# EAGLE schematic untitled (EAGLE 8.3.0)
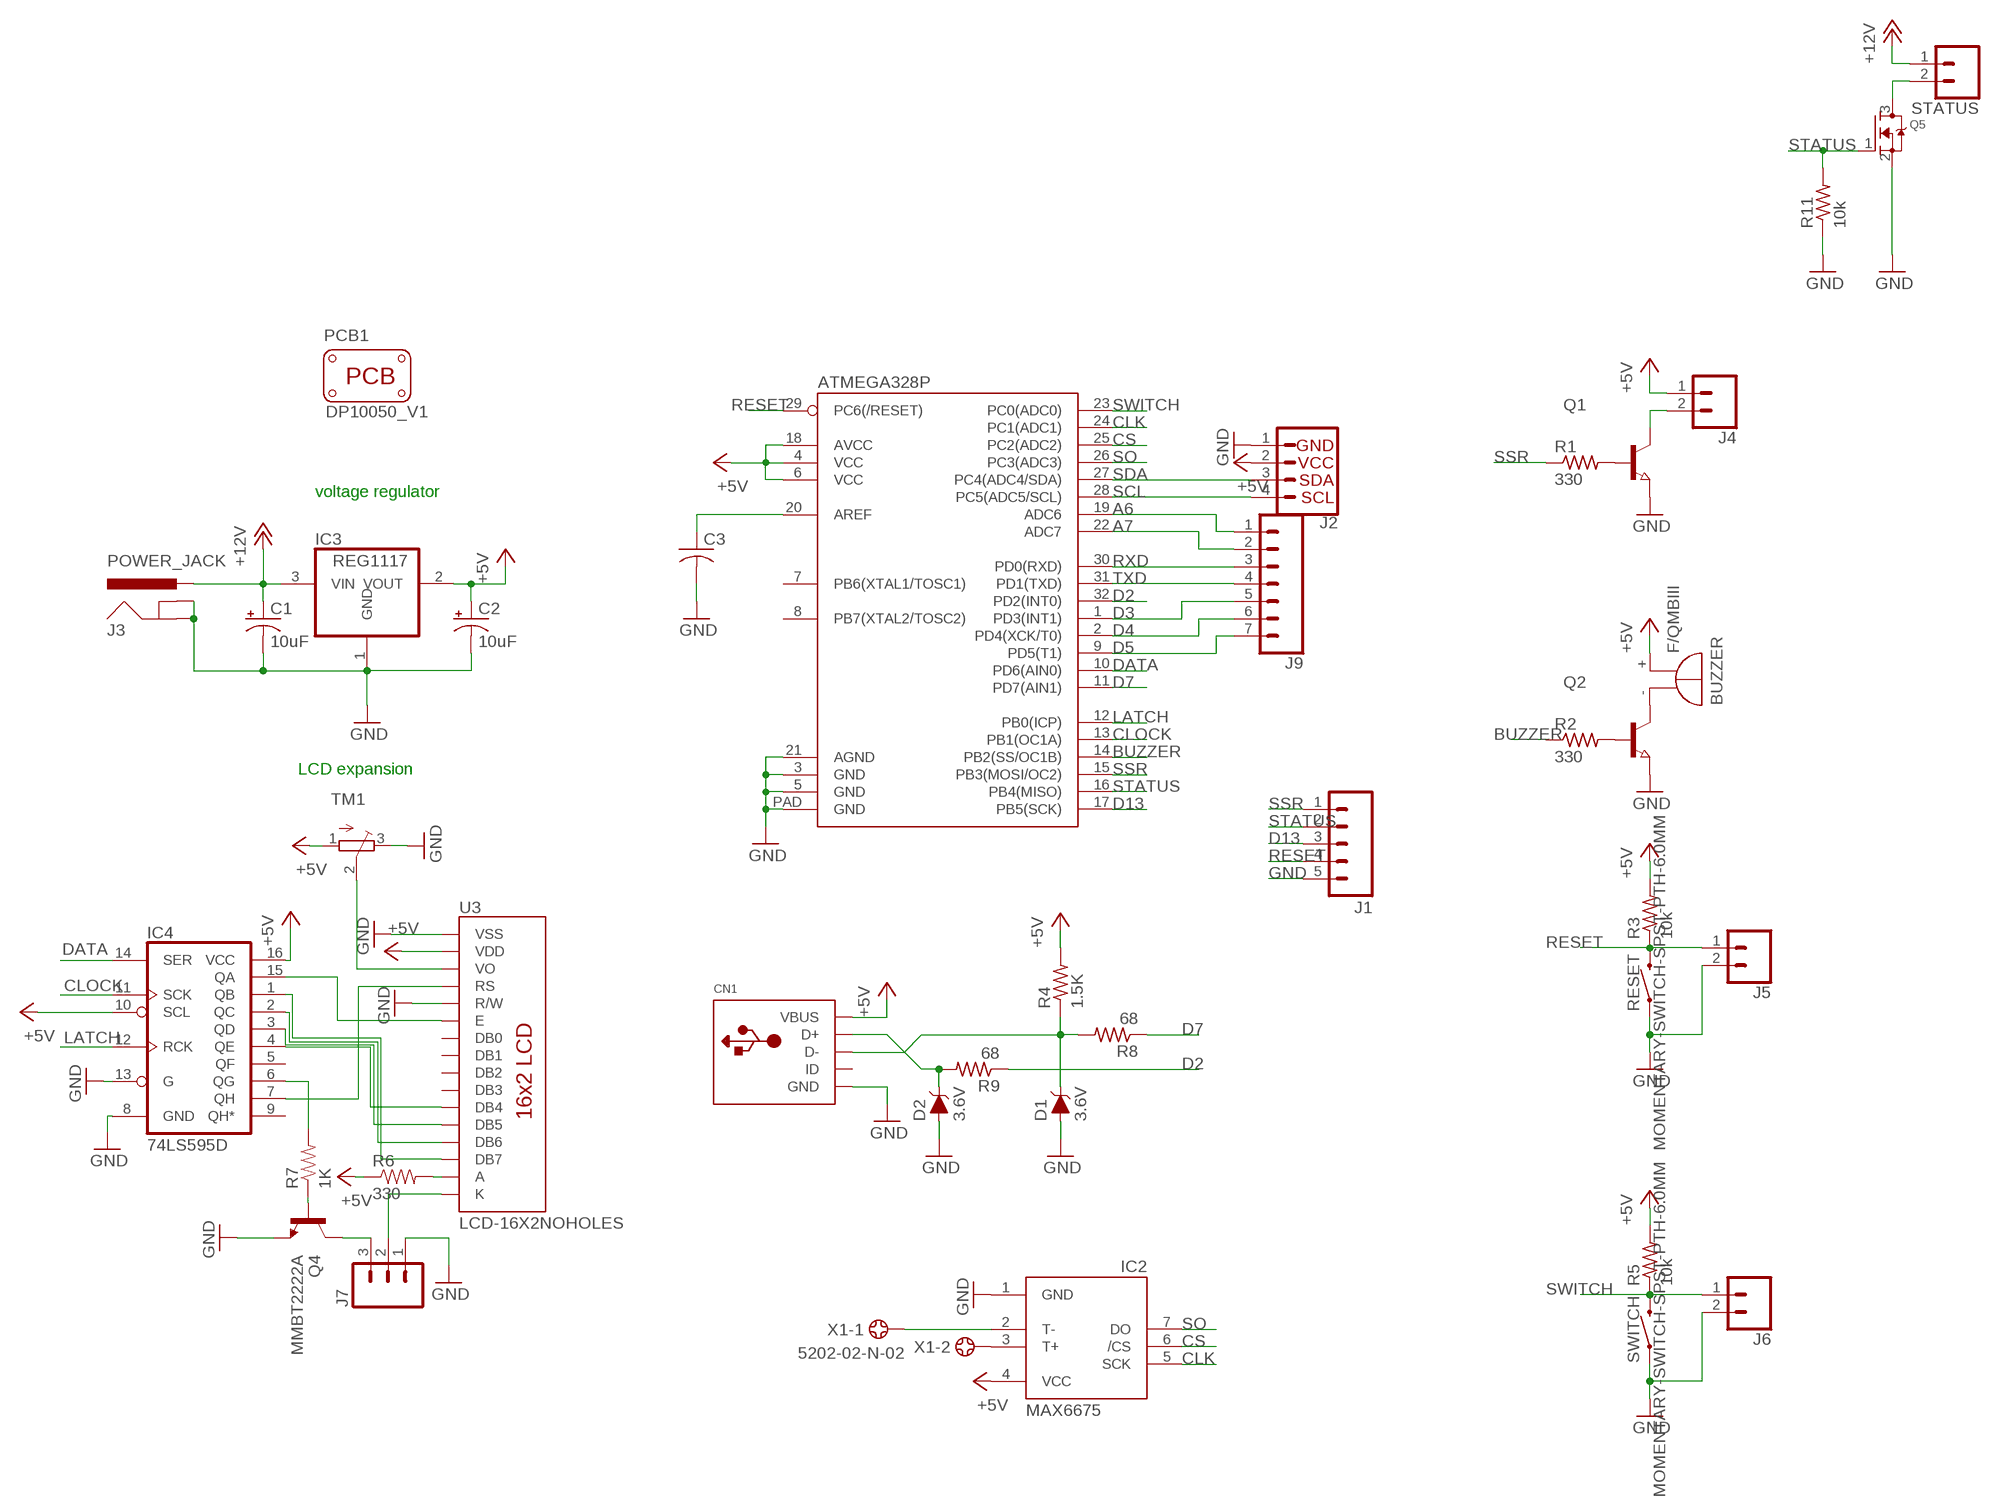
[diagram p0: schematic, sheet 1]

## Parts
ATMEGA328P  ATMEGA328P_MLFMLF32  [MLF32-PAD]
BUZZER  F/QMBIII  [F/QMBIII]
C1  10uF  CPOL-USCT3216  [CT3216]
C2  10uF  CPOL-USCT3216  [CT3216]
C3  C-USC0603  [C0603]
CN1  USBMINIB  [USB-MINIB]
D1  3.6V  DIODE-ZENER-BZT52C3V6S  [SOD-323]
D2  3.6V  DIODE-ZENER-BZT52C3V6S  [SOD-323]
IC2  MAX6675  [SO08]
IC3  REG1117  [SOT223]
IC4  74LS595D  [SO16]
J1  M051.27MM  [1X05-1.27MM]
J2  I2C_STANDARD  [1X04]
J3  POWER_JACK  [POWER_JACK_PTH]
J4  CONN_02  [1X02]
J5  CONN_02  [1X02]
J6  CONN_02  [1X02]
J7  M03PTH  [1X03]
J9  CONN_07  [1X07]
PCB1  PCB_DP_RECTANGLE-50X100  [DP10050_V1]
Q1  NPN-TRANSISTOR_SOT23  [SOT23]
Q2  NPN-TRANSISTOR_SOT23  [SOT23]
Q4  MMBT2222A  TRANSISTOR_NPNMMBT2222A  [SOT23-3]
Q5  MOSFET-NREFLOW  [SOT23]
R1  330  R-US_R0603  [R0603]
R2  330  R-US_R0603  [R0603]
R3  10k  R-US_R0603  [R0603]
R4  1.5K  R-US_R0603  [R0603]
R5  10k  R-US_R0603  [R0603]
R6  330  0.3OHM-1/8W-1%(0805)  [0805]
R7  1K  0.3OHM-1/8W-1%(0805)  [0805]
R8  68  R-US_R0603  [R0603]
R9  68  R-US_R0603  [R0603]
R11  10k  R-US_R0603  [R0603]
RESET  MOMENTARY-SWITCH-SPST-PTH-6.0MM  [TACTILE_SWITCH_PTH_6.0MM]
STATUS  CONN_02  [1X02]
SWITCH  MOMENTARY-SWITCH-SPST-PTH-6.0MM  [TACTILE_SWITCH_PTH_6.0MM]
TM1  TRIMPOT3386  [TRIM-3386]
U3  LCD-16X2NOHOLES  [LCD-16X2_NOHOLES]
X1  5202-02-N-02  [5202-02-N-02]

## Nets
+5V: ATMEGA328P.4(VCC) ATMEGA328P.6(VCC) ATMEGA328P.18(AVCC) BUZZER.+(-) C2.+ CN1.VBUS IC2.4(VCC) IC3.2(VOUT) IC4.10(SCL) IC4.16(VCC) J2.2 J4.1 R3.2 R4.2 R5.2 R6.1 TM1.1(A) U3.2(VDD)
+12V: C1.+ IC3.3(VIN) J3.PWR STATUS.1
A6: ATMEGA328P.19(ADC6) J9.1
A7: ATMEGA328P.22(ADC7) J9.2
BUZZER: ATMEGA328P.14(PB2(SS/OC1B)) R2.1
CLK: ATMEGA328P.24(PC1(ADC1)) IC2.5(SCK)
CLOCK: ATMEGA328P.13(PB1(OC1A)) IC4.11(SCK)
CS: ATMEGA328P.25(PC2(ADC2)) IC2.6(/CS)
D2: ATMEGA328P.32(PD2(INT0)) R9.1
D3: ATMEGA328P.1(PD3(INT1)) J9.5
D4: ATMEGA328P.2(PD4(XCK/T0)) J9.6
D5: ATMEGA328P.9(PD5(T1)) J9.7
D7: ATMEGA328P.11(PD7(AIN1)) R8.1
D13: ATMEGA328P.17(PB5(SCK)) J1.3
DATA: ATMEGA328P.10(PD6(AIN0)) IC4.14(SER)
GND: ATMEGA328P.3(GND) ATMEGA328P.5(GND) ATMEGA328P.21(AGND) ATMEGA328P.PAD(GND) C1.- C2.- C3.2 CN1.GND D1.A D2.A IC2.1(GND) IC3.1(GND) IC4.8(GND) IC4.13(G) J1.5 J2.1 J3.GND J3.GNDBREAK J5.2 J6.2 J7.1 Q1.2(E) Q2.2(E) Q4.2(E) Q5.2(S) R11.1 RESET.1 SWITCH.1 TM1.3(E) U3.1(VSS) U3.5(R/W)
LATCH: ATMEGA328P.12(PB0(ICP)) IC4.12(RCK)
N$1: BUZZER.-(+) Q2.3(C)
N$2: IC2.2(T-) X1.1
N$3: IC2.3(T+) X1.2
N$4: Q1.1(B) R1.2
N$5: Q2.1(B) R2.2
N$6: ATMEGA328P.20(AREF) C3.1
N$7: J4.2 Q1.3(C)
N$8: R6.2 U3.15(A)
N$9: TM1.2(S) U3.3(VO)
N$10: IC4.7(QH) U3.4(RS)
N$11: IC4.15(QA) U3.6(E)
N$12: IC4.4(QE) U3.11(DB4)
N$13: IC4.3(QD) U3.12(DB5)
N$14: IC4.2(QC) U3.13(DB6)
N$15: IC4.1(QB) U3.14(DB7)
N$16: J7.2 U3.16(K)
N$17: J7.3 Q4.3(C)
N$18: Q4.1(B) R7.1
N$19: IC4.6(QG) R7.2
N$20: CN1.D- D1.C R4.1 R8.2
N$21: CN1.D+ D2.C R9.2
N$24: Q5.3(D) STATUS.2
RESET: ATMEGA328P.29(PC6(/RESET)) J1.4 J5.1 R3.1 RESET.3
RXD: ATMEGA328P.30(PD0(RXD)) J9.3
SCL: ATMEGA328P.28(PC5(ADC5/SCL)) J2.4
SDA: ATMEGA328P.27(PC4(ADC4/SDA)) J2.3
SO: ATMEGA328P.26(PC3(ADC3)) IC2.7(DO)
SSR: ATMEGA328P.15(PB3(MOSI/OC2)) J1.1 R1.1
STATUS: ATMEGA328P.16(PB4(MISO)) J1.2 Q5.1(G) R11.2
SWITCH: ATMEGA328P.23(PC0(ADC0)) J6.1 R5.1 SWITCH.3
TXD: ATMEGA328P.31(PD1(TXD)) J9.4
Unconnected: ATMEGA328P.7(PB6(XTAL1/TOSC1)) ATMEGA328P.8(PB7(XTAL2/TOSC2)) CN1.ID IC4.5(QF) IC4.9(QH*) U3.7(DB0) U3.8(DB1) U3.9(DB2) U3.10(DB3)

## Notes on the sheet
- voltage regulator
- LCD expansion

## Library data of the parts
ATMEGA328P = SparkFun-DigitalIC:ATMEGA328P_MLF: 32-Pin Atmega328 part Commonly used on Arduino compatible boards Available in QFP and QFN packages TQFP is IC-09069 QFN is non-stock
BUZZER = buzzer:F/QMBIII: BUZZER Source: Buerklin; OC_FARNELL: unknown; OC_NEWARK: unknown
C1 C2 = adafruit:CPOL-US: POLARIZED CAPACITOR, American symbol
C3 = adafruit:C-US: CAPACITOR, American symbol
CN1 = adafruit:USB: USB Connectors USBMINIB - Surface Mount Female Mini-B USB Connector 4UConnector: 06564 By microbuilder.eu Thru-hole RA Female Mini-B USB Connector 4UConnector: 18732 By ladyada.net
D1 D2 = SparkFun-DiscreteSemi:DIODE-ZENER: Zener Diode A Zener diode allows current to flow from its anode to its cathode like a normal semiconductor diode, but it also permits current to flow in the reverse direction when its "Zener voltage" is reached. - WIkipedia; PROD_ID: DIO-08199
IC2 = adafruit:MAX6675
IC3 = burr-brown:REG1117: 800mA and 1A Low Dropout (LDO) Positive Regulator 1.8V, 2.5V, 2.85V, 3.3V, 5V, and Adj; MPN: REG1117; OC_FARNELL: 1097566; OC_NEWARK: 14P6981
IC4 = SparkFun-DigitalIC:74*595: 8-bit SHIFT REGISTER, output latch; PROD_ID: IC-07875
J1 = Rheyd:M05: Header 5 Standard 5-pin 0.1" header. Use with straight break away headers (SKU : PRT-00116), right angle break away headers (PRT-00553), swiss pins (PRT-00743), machine pins (PRT-00117), and female headers (PRT-00115). Molex polarized connector foot print use with SKU : PRT-08230 with associated crimp pins and housings.
J2 = SparkFun-Connectors:I2C_STANDARD: SparkFun I2C Standard Pinout Header SparkFun has standardized on a pinout for all I2C based sensor breakouts. This pinout allows I2C boards to be plugged directly into the headers on Arduino Uno compatible boards, and to be daisy chained easily. Example SparkFun Products: SparkFun Atmospheric Sensor Breakout - BME280 <https://www.sparkfun.com/products/13676> SparkFun Altitude/Pressure Sensor Breakout - MPL3115A2 <https://www.sparkfun.com/products/11084> SparkFun TOF Range Finder Sensor - VL6180 <https://www.sparkfun.com/products/12785>
J3 = SparkFun-Connectors:POWER_JACK: Power Jack Connector This is the standard 5.5mm barrel jack for power. The PTH is the most common, proven, reliable, footprint. The Slot footprint only works if the mill layer is transmitted to the PCB fab house so be warned. Here are the connectors we sell at SparkFun: DC Barrel Power Jack/Connector <https://www.sparkfun.com/products/119> (PRT-00119) DC Barrel Power Jack/Connector (SMD) <https://www.sparkfun.com/products/12748> (PRT-12748) DC Barrel Jack Adapter - Breadboard Compatible <https://www.sparkfun.com/products/10811> (PRT-10811) It is used on this SparkFun product (and many, many others): SparkFun RedBoard - Programmed with Arduino <https://www.sparkfun.com/products/12757> (DEV-12757) Also, if you need a mating power supply or connector, please check these out: Wall Adapter Power Supply - 9VDC 650mA <https://www.sparkfun.com/products/298> (TOL-00298) DC Barrel Jack Adapter - Male <https://www.sparkfun.com/products/10287> (PRT-10287); PROD_ID: CONN-08197
J4-J6 STATUS = SparkFun-Connectors:CONN_02: Multi connection point. Often used as Generic Header-pin footprint for 0.1 inch spaced/style header connections On any of the 0.1 inch spaced packages, you can populate with these: Break Away Headers - Straight <https://www.sparkfun.com/products/116> (PRT-00116) Break Away Male Headers - Right Angle <https://www.sparkfun.com/products/553> (PRT-00553) Female Headers <https://www.sparkfun.com/products/115> (PRT-00115) Break Away Headers - Machine Pin <https://www.sparkfun.com/products/117> (PRT-00117) Break Away Female Headers - Swiss Machine Pin <https://www.sparkfun.com/products/743> (PRT-00743) For SCREWTERMINALS and SPRING TERMINALS visit here: Screw Terimnals on SparkFun.com <https://www.sparkfun.com/search/results?term=Screw+Terminals> (5mm/3.5mm/2.54mm spacing) This device is also useful as a general connection point to wire up your design to another part of your project. Our various solder wires solder well into these plated through hole pads. Hook-Up Wire - Assortment (Stranded, 22 AWG) <https://www.sparkfun.com/products/11375> (PRT-11375) Hook-Up Wire - Assortment (Solid Core, 22 AWG) <https://www.sparkfun.com/products/11367> (PRT-11367) View the entire wire category on our website here <https://www.sparkfun.com/categories/141> Special notes: Molex polarized connector foot print use with: PRT-08233 with associated crimp pins and housings. 2.54_SCREWTERM for use with PRT-10571. 3.5mm Screw Terminal footprints for PRT-08084 5mm Screw Terminal footprints for use with PRT-08432
J7 = SparkFun-Connectors:M03: Header 3 Standard 3-pin 0.1" header. Use with straight break away headers (SKU : PRT-00116), right angle break away headers (PRT-00553), swiss pins (PRT-00743), machine pins (PRT-00117), and female headers (PRT-00115). Molex polarized connector foot print use with SKU : PRT-08232 with associated crimp pins and housings.
J9 = SparkFun-Connectors:CONN_07: Multi connection point. Often used as Generic Header-pin footprint for 0.1 inch spaced/style header connections On any of the 0.1 inch spaced packages, you can populate with these: Break Away Headers - Straight <https://www.sparkfun.com/products/116> (PRT-00116) Break Away Male Headers - Right Angle <https://www.sparkfun.com/products/553> (PRT-00553) Female Headers <https://www.sparkfun.com/products/115> (PRT-00115) Break Away Headers - Machine Pin <https://www.sparkfun.com/products/117> (PRT-00117) Break Away Female Headers - Swiss Machine Pin <https://www.sparkfun.com/products/743> (PRT-00743) For SCREWTERMINALS and SPRING TERMINALS visit here: Screw Terimnals on SparkFun.com <https://www.sparkfun.com/search/results?term=Screw+Terminals> (5mm/3.5mm/2.54mm spacing) This device is also useful as a general connection point to wire up your design to another part of your project. Our various solder wires solder well into these plated through hole pads. Hook-Up Wire - Assortment (Stranded, 22 AWG) <https://www.sparkfun.com/products/11375> (PRT-11375) Hook-Up Wire - Assortment (Solid Core, 22 AWG) <https://www.sparkfun.com/products/11367> (PRT-11367) View the entire wire category on our website here <https://www.sparkfun.com/categories/141> Special notes: Molex polarized connector foot print use with SKU : PRT-08231 with associated crimp pins and housings. 1MM SMD Version SKU: PRT-10208 NOTES ON THE VARIANTS LOCK and LOCK_LONGPADS... This footprint was designed to help hold the alignment of a through-hole component (i.e. 6-pin header) while soldering it into place. You may notice that each hole has been shifted either up or down by 0.005 of an inch from it's more standard position (which is a perfectly straight line). This slight alteration caused the pins (the squares in the middle) to touch the edges of the holes. Because they are alternating, it causes a "brace" to hold the component in place. 0.005 has proven to be the perfect amount of "off-center" position when using our standard breakaway headers. Although looks a little odd when you look at the bare footprint, once you have a header in there, the alteration is very hard to notice. Also,if you push a header all the way into place, it is covered up entirely on the bottom side.
PCB1 = dp_devices:PCB_DP_RECTANGLE: Dangerous Prototypes Standard Rectangular PCB sizes; PCB_SIZE: DP10050_V1
Q1 Q2 = semicon-smd-ipc:NPN-TRANSISTOR_: NPN TRANSISTOR
Q4 = SparkFun-DiscreteSemi:TRANSISTOR_NPN: Generic NPN BJT MMBT2222A - TRANS-08049 (SOT-23, 1A 40V) MPSA42 - TRANS-09116 (SOT-23, 500mA 300V) MMBT5088LT1G - TRANS-11160 (SOT-23, 50 mA 30V) BC547 - COM-08928 <http://www.sparkfun.com/products/8928> (TO-92 45V 100mA) (1.Collector 2.Base 3.Emitter) 2N3904 - COM-00521 <http://www.sparkfun.com/products/521> (TO-92 40V 200mA) (1.Emitter 2.Base 3.Collector) P2N2222A - COM-12852 <http://www.sparkfun.com/products/12852> (TO-92 40V 600mA) (1.Collector 2.Base 3.Emitter); PROD_ID: TRANS-08049
Q5 = adafruit:MOSFET-N: N-Channel Mosfet 2N7002E - 60V 260mA SOT23 [Digikey: 2N7002ET1GOSTR-ND] - REEL BSH103 - 30V 850mA SOT23 [Digikey: 568-5013-1-ND]
R1-R5 R8 R9 R11 = adafruit:R-US_: RESISTOR, American symbol
R6 R7 = SparkFun-Resistors:0.3OHM-1/8W-1%(0805): RES-11622; PROD_ID: RES-11622; VALUE: 0.3
RESET SWITCH = SparkFun-Switches:MOMENTARY-SWITCH-SPST: Momentary Switch (Pushbutton) - SPST Normally-open (NO) SPST momentary switches (buttons, pushbuttons). Variants PTH-12MM - 12mm square, through-hole Momentary Pushbutton Switch - 12mm Square <https://www.sparkfun.com/products/9190> (COM-09190) PTH-6.0MM, PTH-6.0MM-KIT - 6.0mm square, through-hole Mini Pushbutton Switch <https://www.sparkfun.com/products/97> (COM-00097) KIT package intended for soldering kit's - only one side of pads' copper is exposed. PTH-RIGHT-ANGLE-KIT - Right-angle, through-hole Right Angle Tactile Button <https://www.sparkfun.com/products/10791> - Used on SparkFun BigTime Watch Kit <https://www.sparkfun.com/products/11734> SMD-12MM - 12mm square, surface-mount Tactile Button - SMD (12mm) <https://www.sparkfun.com/products/12993> (COM-12993) Used on SparkFun PicoBoard <https://www.sparkfun.com/products/11888> SMD-4.5MM - 4.5mm Square Trackball Switch Used on SparkFun Blackberry Trackballer Breakout <https://www.sparkfun.com/products/13169> SMD-4.6MMX2.8MM - 4.60mm x 2.80mm, surface mount Used on SparkFun SAMD21 Mini Breakout <https://www.sparkfun.com/products/13664> SMD-5.2MM, SMD-5.2-REDUNDANT - 5.2mm square, surface-mount Mini Pushbutton Switch - SMD <https://www.sparkfun.com/products/8720> (COM-08720) Used on Arduino Pro Mini <https://www.sparkfun.com/products/11114> REDUNDANT package connects both switch circuits together SMD-6.0X3.5MM - 6.0 x 3.5mm, surface mount Momentary Reset Switch SMD <https://www.sparkfun.com/products/8229> (COM-08229) SMD-6.2MM-TALL - 6.2mm square, surface mount Tactile Button - SMD (6mm) <https://www.sparkfun.com/products/12992> Used on SparkFun Digital Sandbox <https://www.sparkfun.com/products/12651> SMD-RIGHT-ANGLE - Right-angle, surface mount Used on SparkFun Block for Intel® Edison - Arduino <https://www.sparkfun.com/products/13036>; PROD_ID: SWCH-08441; SF_SKU: COM-00097
TM1 = adafruit:TRIMPOT: SMT trimmer potentiometer part number TC33X http://www.ladyada.net/library/eagle
U3 = SparkFun-Displays:LCD-16X2: Standard text-only 16x2 parallel input LCD
X1 = con-ebyelectro:5202-02-N-02: Barrier Blocks Sreies 5202 Source: http://www.ebyelectro.com/PDF/5202-XX-N-02.pdf